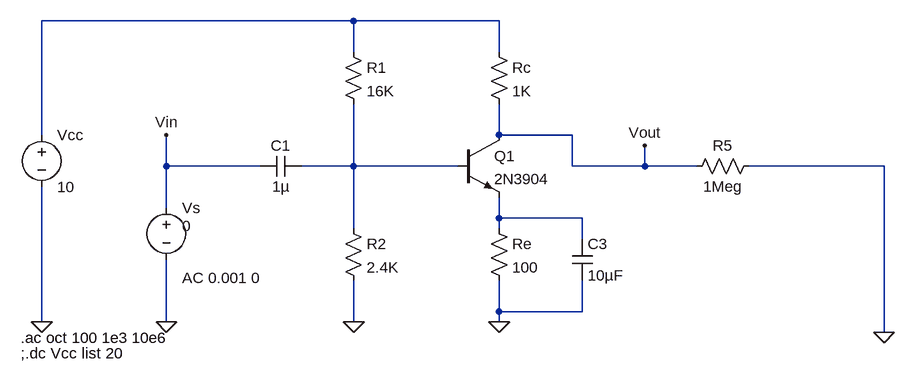
[diagram p0: schematic transistor_common_emitter.asc]
transistor_common_emitter.asc, the LTspice schematic file:
Version 4
SHEET 1 1348 680
WIRE 32 32 -448 32
WIRE 256 32 32 32
WIRE 32 80 32 32
WIRE 256 80 256 32
WIRE -448 208 -448 32
WIRE 256 208 256 160
WIRE 368 208 256 208
WIRE -256 256 -256 208
WIRE -112 256 -256 256
WIRE 32 256 32 160
WIRE 32 256 -48 256
WIRE 192 256 32 256
WIRE 368 256 368 208
WIRE 480 256 480 224
WIRE 480 256 368 256
WIRE 560 256 480 256
WIRE 848 256 640 256
WIRE -256 320 -256 256
WIRE 256 336 256 304
WIRE 384 336 256 336
WIRE 32 352 32 256
WIRE 256 352 256 336
WIRE 384 368 384 336
WIRE 256 480 256 432
WIRE 384 480 384 432
WIRE 384 480 256 480
WIRE -448 496 -448 288
WIRE -256 496 -256 400
WIRE 32 496 32 432
WIRE 256 496 256 480
WIRE 848 512 848 256
FLAG 256 496 0
FLAG 32 496 0
FLAG -256 496 0
FLAG -448 496 0
FLAG 480 224 Vout
FLAG -256 208 Vin
FLAG 848 512 0
SYMBOL res 16 64 R0
SYMATTR InstName R1
SYMATTR Value 16K
SYMBOL res 16 336 R0
SYMATTR InstName R2
SYMATTR Value 2.4K
SYMBOL res 240 64 R0
SYMATTR InstName Rc
SYMATTR Value 1K
SYMBOL res 240 336 R0
SYMATTR InstName Re
SYMATTR Value 100
SYMBOL npn 192 208 R0
SYMATTR InstName Q1
SYMATTR Value 2N3904
SYMBOL cap -48 240 R90
WINDOW 0 0 32 VBottom 2
WINDOW 3 32 32 VTop 2
SYMATTR InstName C1
SYMATTR Value 1µ
SYMBOL voltage -448 192 R0
WINDOW 123 0 0 Left 0
WINDOW 39 0 0 Left 0
SYMATTR InstName Vcc
SYMATTR Value 10
SYMBOL voltage -256 304 R0
WINDOW 123 24 124 Left 2
WINDOW 39 0 0 Left 0
WINDOW 3 24 44 Left 2
SYMATTR Value2 AC 0.001 0
SYMATTR Value 0
SYMATTR InstName Vs
SYMBOL res 656 240 R90
WINDOW 0 0 56 VBottom 2
WINDOW 3 32 56 VTop 2
SYMATTR InstName R5
SYMATTR Value 1Meg
SYMBOL cap 368 368 R0
SYMATTR InstName C3
SYMATTR Value 10µF
TEXT -480 520 Left 2 !.ac oct 100 1e3 10e6
TEXT -480 544 Left 2 !;.dc Vcc list 20

The netlist it stands for:
* transistor_common_emitter.asc
R1 N001 N002 16K
R2 N002 0 2.4K
Rc N001 Vout 1K
Re N003 0 100
Q1 Vout N002 N003 0 2N3904
C1 N002 Vin 1µ
Vcc N001 0 10
Vs Vin 0 0 AC 0.001 0
R5 0 Vout 1Meg
C3 N003 0 10µF
.model NPN NPN
.model PNP PNP
.lib standard.bjt
.ac oct 100 1e3 10e6
;.dc Vcc list 20
.backanno
.end